# Altium project MQP_DC_AC_Inverter.PrjPcb (part 1 of 4)
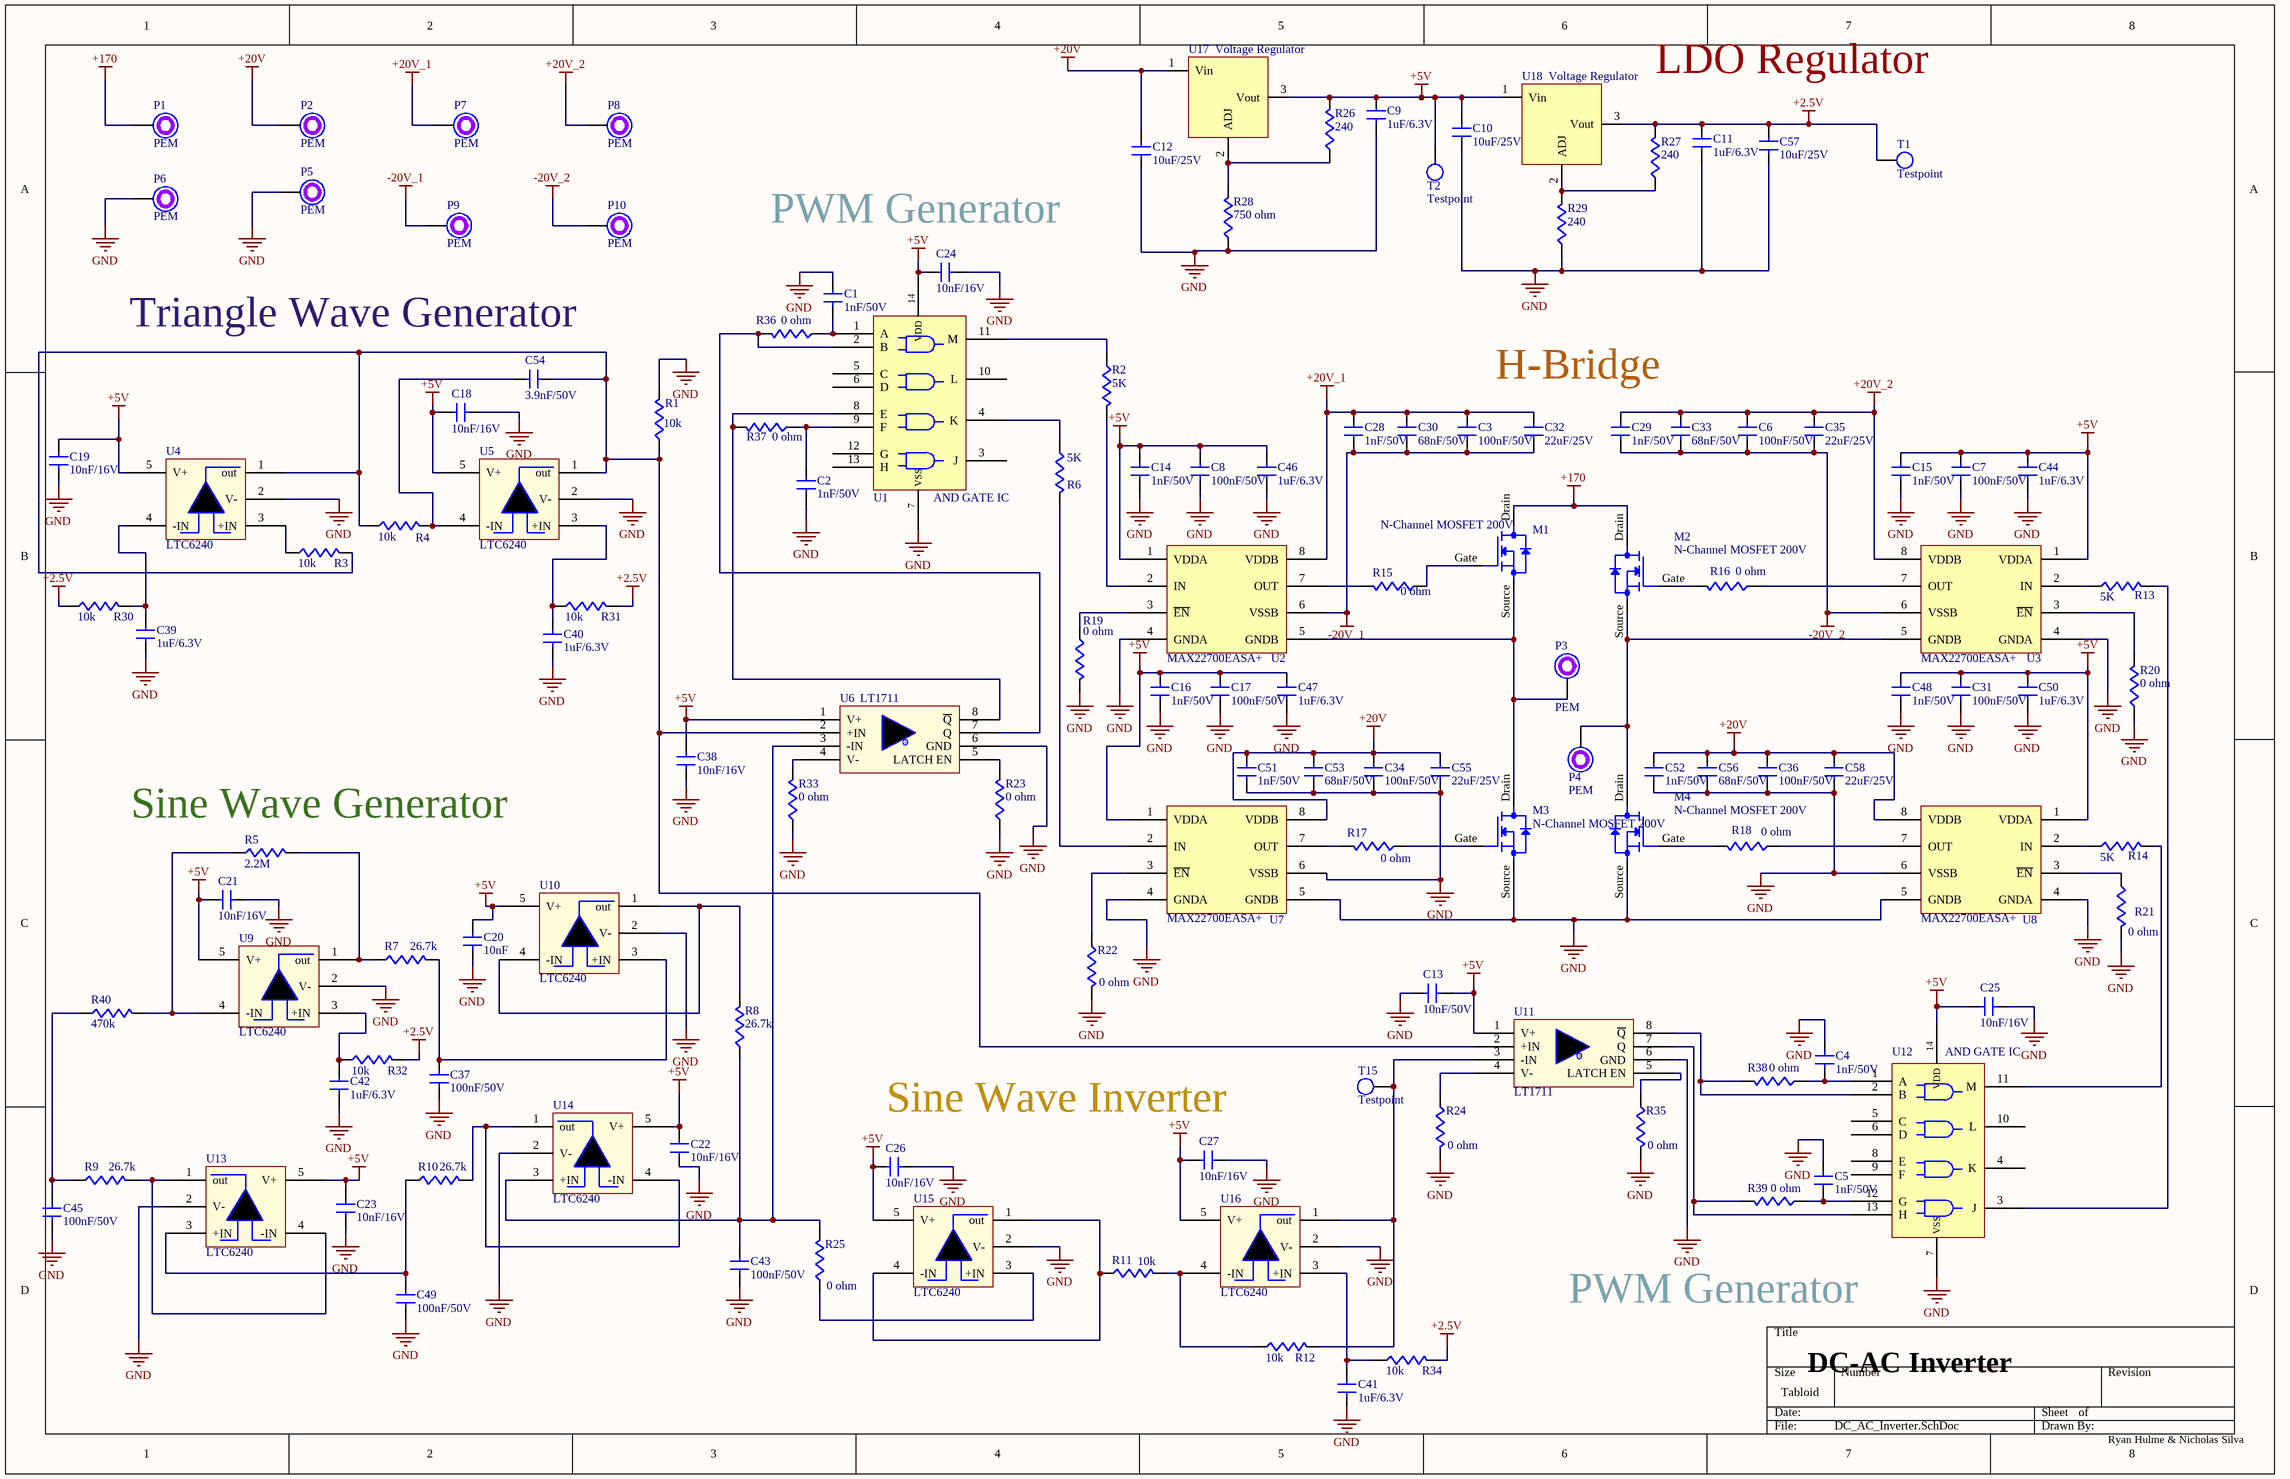
[diagram p0: DC_AC_Inverter.SchDoc]
1 sheet, 133 parts. Net scope: global (net labels, ports and power ports of the same name join across sheets).
Board file: DC_AC_Inverter.PcbDoc

## Sheet DC_AC_Inverter.SchDoc
size Tabloid; SheetNumber: 1; SheetTotal: 1

### Parts
C1  1nF/50V  [Capacitor]
C2  1nF/50V  [Capacitor]
C3  100nF/50V  [Capacitor]
C4  1nF/50V  [Capacitor]
C5  1nF/50V  [Capacitor]
C6  100nF/50V  [Capacitor]
C7  100nF/50V  [Capacitor]
C8  100nF/50V  [Capacitor]
C9  1uF/6.3V  [Capacitor]
C10  10uF/25V  [Capacitor]
C11  1uF/6.3V  [Capacitor]
C12  10uF/25V  [Capacitor]
C13  10nF/50V  [Capacitor]
C14  1nF/50V  [Capacitor]
C15  1nF/50V  [Capacitor]
C16  1nF/50V  [Capacitor]
C17  100nF/50V  [Capacitor]
C18  10nF/16V  [Capacitor]
C19  10nF/16V  [Capacitor]
C20  10nF  [Capacitor]
C21  10nF/16V  [Capacitor]
C22  10nF/16V  [Capacitor]
C23  10nF/16V  [Capacitor]
C24  10nF/16V  [Capacitor]
C25  10nF/16V  [Capacitor]
C26  10nF/16V  [Capacitor]
C27  10nF/16V  [Capacitor]
C28  1nF/50V  [Capacitor]
C29  1nF/50V  [Capacitor]
C30  68nF/50V  [Capacitor]
C31  100nF/50V  [Capacitor]
C32  22uF/25V  [Capacitor]
C33  68nF/50V  [Capacitor]
C34  100nF/50V  [Capacitor]
C35  22uF/25V  [Capacitor]
C36  100nF/50V  [Capacitor]
C37  100nF/50V  [Capacitor]
C38  10nF/16V  [Capacitor]
C39  1uF/6.3V  [Capacitor]
C40  1uF/6.3V  [Capacitor]
C41  1uF/6.3V  [Capacitor]
C42  1uF/6.3V  [Capacitor]
C43  100nF/50V  [Capacitor]
C44  1uF/6.3V  [Capacitor]
C45  100nF/50V  [Capacitor]
C46  1uF/6.3V  [Capacitor]
C47  1uF/6.3V  [Capacitor]
C48  1nF/50V  [Capacitor]
C49  100nF/50V  [Capacitor]
C50  1uF/6.3V  [Capacitor]
C51  1nF/50V  [Capacitor]
C52  1nF/50V  [Capacitor]
C53  68nF/50V  [Capacitor]
C54  3.9nF/50V  [Capacitor]
C55  22uF/25V  [Capacitor]
C56  68nF/50V  [Capacitor]
C57  10uF/25V  [Capacitor]
C58  22uF/25V  [Capacitor]
M1  N-Channel MOSFET 200V  [SOT89-254P1058X483-3N]
M2  N-Channel MOSFET 200V  [SOT89-254P1058X483-3N]
M3  N-Channel MOSFET 200V  [SOT89-254P1058X483-3N]
M4  N-Channel MOSFET 200V  [SOT89-254P1058X483-3N]
P1  PEM  [PEMs]
P2  PEM  [PEMs]
P3  PEM  [PEMs]
P4  PEM  [PEMs]
P5  PEM  [PEMs]
P6  PEM  [PEMs]
P7  PEM  [PEMs]
P8  PEM  [PEMs]
P9  PEM  [PEMs]
P10  PEM  [PEMs]
R1  10k  [R0805]
R2  5K  [Resis5k]
R3  10k  [R0805]
R4  10k  [R0805]
R5  2.2M  [Resistor-26.7]
R6  5K  [Resis5k]
R7  26.7k  [Resistor-26.7]
R8  26.7k  [Resistor-26.7]
R9  26.7k  [Resistor-26.7]
R10  26.7k  [Resistor-26.7]
R11  10k  [R0805]
R12  10k  [R0805]
R13  5K  [Resis5k]
R14  5K  [Resis5k]
R15  0 ohm  [Resistor-26.7]
R16  0 ohm  [Resistor-26.7]
R17  0 ohm  [Resistor-26.7]
R18  0 ohm  [Resistor-26.7]
R19  0 ohm  [Resistor-26.7]
R20  0 ohm  [Resistor-26.7]
R21  0 ohm  [Resistor-26.7]
R22  0 ohm  [Resistor-26.7]
R23  0 ohm  [Resistor-26.7]
R24  0 ohm  [Resistor-26.7]
R25  0 ohm  [Resistor-26.7]
R26  240  [Resistor-26.7]
R27  240  [Resistor-26.7]
R28  750 ohm  [Resistor-26.7]
R29  240  [Resistor-26.7]
R30  10k  [R0805]
R31  10k  [R0805]
R32  10k  [R0805]
R33  0 ohm  [Resistor-26.7]
R34  10k  [R0805]
R35  0 ohm  [Resistor-26.7]
R36  0 ohm  [Resistor-26.7]
R37  0 ohm  [Resistor-26.7]
R38  0 ohm  [Resistor-26.7]
R39  0 ohm  [Resistor-26.7]
R40  470k  [Resistor-26.7]
T1  Testpoint  [Testpoints]
T2  Testpoint  [Testpoints]
T15  Testpoint  [Testpoints]
U1  AND GATE IC  [ANDLOGICIC]
U2  MAX22700EASA+  [MAX227]
U3  MAX22700EASA+  [MAX227]
U4  LTC6240  [LTC6240]
U5  LTC6240  [LTC6240]
U6  LT1711  [LT1711]
U7  MAX22700EASA+  [MAX227]
U8  MAX22700EASA+  [MAX227]
U9  LTC6240  [LTC6240]
U10  LTC6240  [LTC6240]
U11  LT1711  [LT1711]
U12  AND GATE IC  [ANDLOGICIC]
U13  LTC6240  [LTC6240]
U14  LTC6240  [LTC6240]
U15  LTC6240  [LTC6240]
U16  LTC6240  [LTC6240]
U17  Voltage Regulator  [SOT254P700X939-4N]
U18  Voltage Regulator  [SOT254P700X939-4N]

### Nets
+2.5V: C11.2 C57.1 R27.2 R30.1 R31.2 R32.2 R34.2 T1.T U18.3(Vout)
+5V: C7.2 C8.2 C9.2 C10.1 C13.1 C14.2 C15.2 C16.2 C17.2 C18.1 C19.1 C20.1 C21.1 C22.1 C23.1 C24.2 C25.1 C26.1 C27.1 C31.2 C38.1 C44.2 C46.2 C47.2 C48.2 C50.2 R26.2 T2.T U1.14(VDD) U2.1(VDDA) U3.1(VDDA) U4.5(V+) U5.5(V+) U6.1(V+) U7.1(VDDA) U8.1(VDDA) U9.5(V+) U10.5(V+) U11.1(V+) U12.14(VDD) U13.5(V+) U14.5(V+) U15.5(V+) U16.5(V+) U17.3(Vout) U18.1(Vin)
+20V: C12.1 C34.2 C36.2 C51.2 C52.2 C53.2 C55.2 C56.2 C58.2 P2.1 U7.8(VDDB) U8.8(VDDB) U17.1(Vin)
+20V_1: C3.2 C28.2 C30.2 C32.2 P7.1 U2.8(VDDB)
+20V_2: C6.2 C29.2 C33.2 C35.2 P8.1 U3.8(VDDB)
+170: M1.Drain M2.Drain P1.1
-20V_1: C3.1 C28.1 C30.1 C32.1 P9.1 U2.6(VSSB)
-20V_2: C6.1 C29.1 C33.1 C35.1 P10.1 U3.6(VSSB)
GND: C1.2 C2.1 C4.2 C5.2 C7.1 C8.1 C9.1 C10.2 C11.1 C12.2 C13.2 C14.1 C15.1 C16.1 C17.1 C18.2 C19.2 C20.2 C21.2 C22.2 C23.2 C24.1 C25.2 C26.2 C27.2 C31.1 C34.1 C36.1 C37.1 C38.2 C39.2 C40.1 C41.2 C42.1 C43.1 C44.1 C45.1 C46.1 C47.1 C48.1 C49.1 C50.1 C51.1 C52.1 C53.1 C55.1 C56.1 C57.2 C58.1 M3.Source M4.Source P5.1 P6.1 R1.2 R19.2 R20.1 R21.2 R22.2 R23.1 R24.2 R28.1 R29.1 R33.1 R35.2 U1.7(VSS) U2.4(GNDA) U3.4(GNDA) U4.2(V-) U5.2(V-) U6.6(GND) U7.4(GNDA) U7.5(GNDB) U7.6(VSSB) U8.4(GNDA) U8.5(GNDB) U8.6(VSSB) U9.2(V-) U10.2(V-) U11.6(GND) U12.7(VSS) U13.2(V-) U14.2(V-) U15.2(V-) U16.2(V-)
NetC1_1: C1.1 R36.1 U1.1(A)
NetC2_2: C2.2 R37.1 U1.9(F)
NetC4_1: C4.1 R38.1 U12.1(A)
NetC5_1: C5.1 R39.1 U12.12(G)
NetC37_2: C37.2 R7.2 U10.3(+IN)
NetC39_1: C39.1 R30.2 U4.4(-IN)
NetC40_2: C40.2 R31.1 U5.3(+IN)
NetC41_1: C41.1 R34.1 U16.3(+IN)
NetC42_2: C42.2 R32.1 U9.3(+IN)
NetC43_2: C43.2 R8.1 R25.2 U6.3(-IN) U14.3(+IN)
NetC45_2: C45.2 R9.1 R40.1
NetC49_2: C49.2 R10.1 U13.3(+IN)
NetC54_1: C54.1 R4.2 U5.4(-IN)
NetC54_2: C54.2 R1.1 R3.2 R4.1 U4.1(out) U5.1(out) U6.2(+IN) U11.2(+IN)
NetM1_Gate: M1.Gate R15.1
NetM1_Source: M1.Source M3.Drain P3.1 U2.5(GNDB)
NetM2_Gate: M2.Gate R16.2
NetM2_Source: M2.Source M4.Drain P4.1 U3.5(GNDB)
NetM3_Gate: M3.Gate R17.1
NetM4_Gate: M4.Gate R18.2
NetR2_1: R2.1 U1.11(M)
NetR2_2: R2.2 U2.2(IN)
NetR3_1: R3.1 U4.3(+IN)
NetR5_1: R5.1 R40.2 U9.4(-IN)
NetR5_2: R5.2 R7.1 U9.1(out)
NetR6_1: R6.1 U1.4(K)
NetR6_2: R6.2 U7.2(IN)
NetR8_2: R8.2 U10.1(out) U10.4(-IN)
NetR9_2: R9.2 U13.1(out) U13.4(-IN)
NetR10_2: R10.2 U14.1(out) U14.4(-IN)
NetR11_1: R11.1 U15.1(out) U15.4(-IN)
NetR11_2: R11.2 R12.1 U16.4(-IN)
NetR12_2: R12.2 T15.T U11.3(-IN) U16.1(out)
NetR13_1: R13.1 U3.2(IN)
NetR13_2: R13.2 U12.3(J)
NetR14_1: R14.1 U8.2(IN)
NetR14_2: R14.2 U12.11(M)
NetR15_2: R15.2 U2.7(OUT)
NetR16_1: R16.1 U3.7(OUT)
NetR17_2: R17.2 U7.7(OUT)
NetR18_1: R18.1 U8.7(OUT)
NetR19_1: R19.1 U2.3(~{EN})
NetR20_2: R20.2 U3.3(~{EN})
NetR21_1: R21.1 U8.3(~{EN})
NetR22_1: R22.1 U7.3(~{EN})
NetR23_2: R23.2 U6.5(LATCH_EN)
NetR24_1: R24.1 U11.4(V-)
NetR25_1: R25.1 U15.3(+IN)
NetR26_1: R26.1 R28.2 U17.2(ADJ)
NetR27_1: R27.1 R29.2 U18.2(ADJ)
NetR33_2: R33.2 U6.4(V-)
NetR35_1: R35.1 U11.5(LATCH_EN)
NetR36_2: R36.2 U1.2(B) U6.7(Q)
NetR37_2: R37.2 U1.8(E) U6.8(~{Q})
NetR38_2: R38.2 U11.8(~{Q}) U12.2(B)
NetR39_2: R39.2 U11.7(Q) U12.13(H)

Not connected (* = marked no-connect by the designer): U1 3(J) 5(C) 6(D) 10(L) 12(G) 13(H); U12 4(K) 5(C) 6(D) 8(E) 9(F) 10(L)

### Notes on the sheet
- LDO Regulator
- PWM Generator
- Triangle Wave Generator
- H-Bridge
- (near R5) Sine Wave Generator
- Sine Wave Inverter
- DC-AC Inverter
- Ryan Hulme & Nicholas Silva